# Altium schematic sheet QCopterFC_SD_Sch.SchDoc
size A4
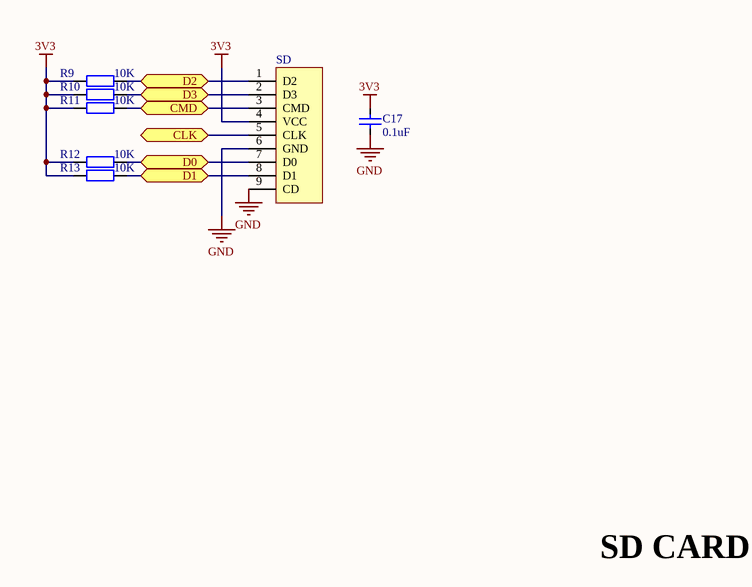
[diagram p0: QCopterFC_SD_Sch.SchDoc]

## Parts
C17  value 0.1uF  [CAP_0603]  (hidden comment: Cap_0603)
R9  value 10K  [RES_0603]  (hidden comment: Res_0603)
R10  value 10K  [RES_0603]  (hidden comment: Res_0603)
R11  value 10K  [RES_0603]  (hidden comment: Res_0603)
R12  value 10K  [RES_0603]  (hidden comment: Res_0603)
R13  value 10K  [RES_0603]  (hidden comment: Res_0603)
SD  SD_Card_TF  [SD_Card_TF]  (value not drawn)

## Ports
CLK, CMD, D0, D1, D2, D3

## Nets
3V3: C17.2 R9.1 R10.1 R11.1 R12.1 R13.1 SD.4(VCC)
GND: C17.1 SD.6(GND) SD.9(CD)
CLK: SD.5(CLK) ; port CLK
CMD: R11.2 SD.3(CMD) ; port CMD
D0: R12.2 SD.7(D0) ; port D0
D1: R13.2 SD.8(D1) ; port D1
D2: R9.2 SD.1(D2) ; port D2
D3: R10.2 SD.2(D3) ; port D3

## Notes on the sheet
- Labels drawn without touching a wire or pin: SD CARD

## Library data of the parts
C17 = Cap_0603: Capacitor
R9-R13 = Res_0603: Resistor
SD = SD_Card_TF: SD